# Altium project drone.PrjPcb
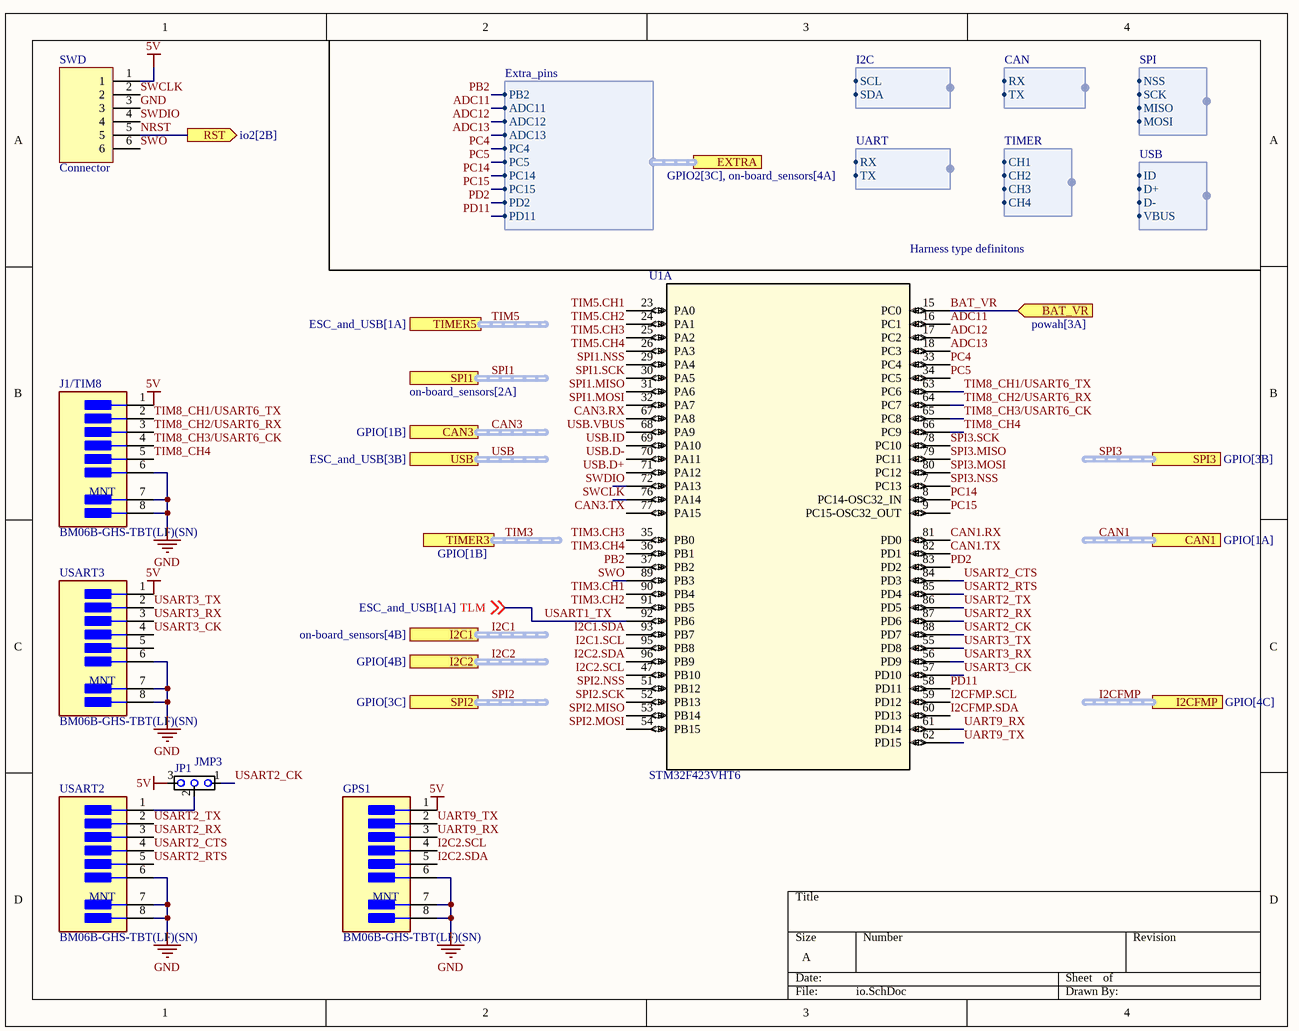
[diagram p0: io.SchDoc]
7 sheets, 93 parts. Net scope: flat (ports and power ports of the same name join across sheets).
Board file: PCB1.PcbDoc
Sheets:
  io.SchDoc
  io2.SchDoc
  powah.SchDoc
  on-board_sensors.SchDoc
  ESC_and_USB.SchDoc
  GPIO.SchDoc
  GPIO2.SchDoc

## Sheet io.SchDoc
size A; SheetNumber: 1; SheetTotal: 7

### Parts
GPS1  BM06B-GHS-TBT(LF)(SN)  [FP-SM06B-GHS-TB_LF_SN-MFG]
J1/TIM8  BM06B-GHS-TBT(LF)(SN)  [FP-SM06B-GHS-TB_LF_SN-MFG]
JP1  JMP3  [JMP3]
SWD  Connector  [FP_CONN6_TAP_254MM]
U1  STM32F423VHT6  [LQFP100-14x14mm]  (part A of 3)
USART2  BM06B-GHS-TBT(LF)(SN)  [FP-SM06B-GHS-TB_LF_SN-MFG]
USART3  BM06B-GHS-TBT(LF)(SN)  [FP-SM06B-GHS-TB_LF_SN-MFG]

### Ports
BAT_VR (in, see powah[3A]), CAN1 (harness CAN, see GPIO[1A]), CAN3 (harness CAN, see GPIO[1B]), EXTRA (harness Extra_pins, see GPIO2[3C], on-board_sensors[4A]), I2C1 (harness I2C, see on-board_sensors[4B]), I2C2 (harness I2C, see GPIO[4B]), I2CFMP (harness I2C, see GPIO[4C]), RST (out, see io2[2B]), SPI1 (harness SPI, see on-board_sensors[2A]), SPI2 (harness SPI, see GPIO[3C]), SPI3 (harness SPI, see GPIO[3B]), TIMER3 (harness TIMER, see GPIO[1B]), TIMER5 (harness TIMER, see ESC_and_USB[1A]), USB (harness USB, see ESC_and_USB[3B])

### Harnesses
USB: ID, D+, D-, VBUS
SPI: NSS, SCK, MISO, MOSI
TIMER: CH1, CH2, CH3, CH4
CAN: RX, TX
I2C: SCL, SDA
Extra_pins: PB2, ADC11, ADC12, ADC13, PC4, PC5, PC14, PC15, PD2, PD11
UART: RX, TX

### Nets
5V: GPS1.1 J1/TIM8.1 JP1.3 SWD.1 USART3.1
GND: GPS1.6 GPS1.7(MNT_1) GPS1.8(MNT_2) J1/TIM8.6 J1/TIM8.7(MNT_1) J1/TIM8.8(MNT_2) SWD.3 USART2.6 USART2.7(MNT_1) USART2.8(MNT_2) USART3.6 USART3.7(MNT_1) USART3.8(MNT_2)
ADC11: U1.16(PC1) ; port EXTRA.ADC11
ADC12: U1.17(PC2) ; port EXTRA.ADC12
ADC13: U1.18(PC3) ; port EXTRA.ADC13
BAT_VR: U1.15(PC0) ; port BAT_VR
CAN1.RX: U1.81(PD0)
CAN1.TX: U1.82(PD1)
CAN3.RX: U1.67(PA8)
CAN3.TX: U1.77(PA15)
I2C1.SCL: U1.95(PB8)
I2C1.SDA: U1.93(PB7)
I2C2.SCL: GPS1.4 U1.47(PB10)
I2C2.SDA: GPS1.5 U1.96(PB9)
I2CFMP.SCL: U1.59(PD12)
I2CFMP.SDA: U1.60(PD13)
NRST: SWD.5 ; port RST
PB2: U1.37(PB2) ; port EXTRA.PB2  [project net Extra.PB2]
PC4: U1.33(PC4) ; port EXTRA.PC4  [project net Extra.PC4]
PC5: U1.34(PC5) ; port EXTRA.PC5  [project net Extra.PC5]
PC14: U1.8(PC14-OSC32_IN) ; port EXTRA.PC14  [project net Extra.PC14]
PC15: U1.9(PC15-OSC32_OUT) ; port EXTRA.PC15  [project net Extra.PC15]
PD2: U1.83(PD2) ; port EXTRA.PD2  [project net Extra.PD2]
PD11: U1.58(PD11) ; port EXTRA.PD11  [project net Extra.PD11]
SPI1.MISO: U1.31(PA6)
SPI1.MOSI: U1.32(PA7)
SPI1.NSS: U1.29(PA4)
SPI1.SCK: U1.30(PA5)
SPI2.MISO: U1.53(PB14)
SPI2.MOSI: U1.54(PB15)
SPI2.NSS: U1.51(PB12)
SPI2.SCK: U1.52(PB13)
SPI3.MISO: U1.79(PC11)
SPI3.MOSI: U1.80(PC12)
SPI3.NSS: U1.7(PC13)
SPI3.SCK: U1.78(PC10)
SWCLK: SWD.2 U1.76(PA14)
SWDIO: SWD.4 U1.72(PA13)
SWO: SWD.6 U1.89(PB3)
TIM3.CH1: U1.90(PB4)
TIM3.CH2: U1.91(PB5)
TIM3.CH3: U1.35(PB0)
TIM3.CH4: U1.36(PB1)
TIM5.CH1: U1.23(PA0)
TIM5.CH2: U1.24(PA1)
TIM5.CH3: U1.25(PA2)
TIM5.CH4: U1.26(PA3)
TIM8_CH1/USART6_TX: J1/TIM8.2 U1.63(PC6)
TIM8_CH2/USART6_RX: J1/TIM8.3 U1.64(PC7)
TIM8_CH3/USART6_CK: J1/TIM8.4 U1.65(PC8)
TIM8_CH4: J1/TIM8.5 U1.66(PC9)
TLM: U1.92(PB6) ; off-sheet TLM  [also labelled USART1_TX]
UART9_RX: GPS1.3 U1.61(PD14)
UART9_TX: GPS1.2 U1.62(PD15)
USART2_CK: JP1.1 U1.88(PD7)
USART2_CTS: U1.84(PD3) USART2.4
USART2_RTS: U1.85(PD4) USART2.5
USART2_RX: U1.87(PD6) USART2.3
USART2_TX: U1.86(PD5) USART2.2
USART3_CK: U1.57(PD10) USART3.4
USART3_RX: U1.56(PD9) USART3.3
USART3_TX: U1.55(PD8) USART3.2
USB.D+: U1.71(PA12)
USB.D-: U1.70(PA11)
USB.ID: U1.69(PA10)
USB.VBUS: U1.68(PA9)
NetJP1_2: JP1.2 USART2.1

Not connected (* = marked no-connect by the designer): USART3 5

### Buses and harness runs
harness CAN1 = port CAN1
harness CAN3 = port CAN3
harness I2C1 = port I2C1
harness I2C2 = port I2C2
harness I2CFMP = port I2CFMP
harness SPI1 = port SPI1
harness SPI2 = port SPI2
harness SPI3 = port SPI3
harness TIM3 = port TIMER3
harness TIM5 = port TIMER5
harness USB = port USB

### Notes on the sheet
- Harness type definitons
- (in symbol CMP-17439-000166-1) MNT

### Library data of the parts
GPS1 J1/TIM8 USART2 USART3 = CMP-17439-000166-1: 6p; Pitch: 1.25mm; Number of Contacts: 6; Current Rating: 1A; Voltage Rating: 50V; Housing Material: Nylon; Lead Free: Lead Free; Packaging: Cut Tape; Number of Rows: 1; Series: GH; Contact Material: Bronze; Orientation: Straight; Termination: Solder; Mount: Surface Mount; Housing Color: Natural; Number of Positions: 6
SWD = Connector_6pin: 6pin connector
U1 = STM32F423VHT6: No Description Available; Mfr_Name: STMicroelectronics; RefDes: RefDes; Type: Type

## Sheet io2.SchDoc
size A; SheetNumber: 2; SheetTotal: 7
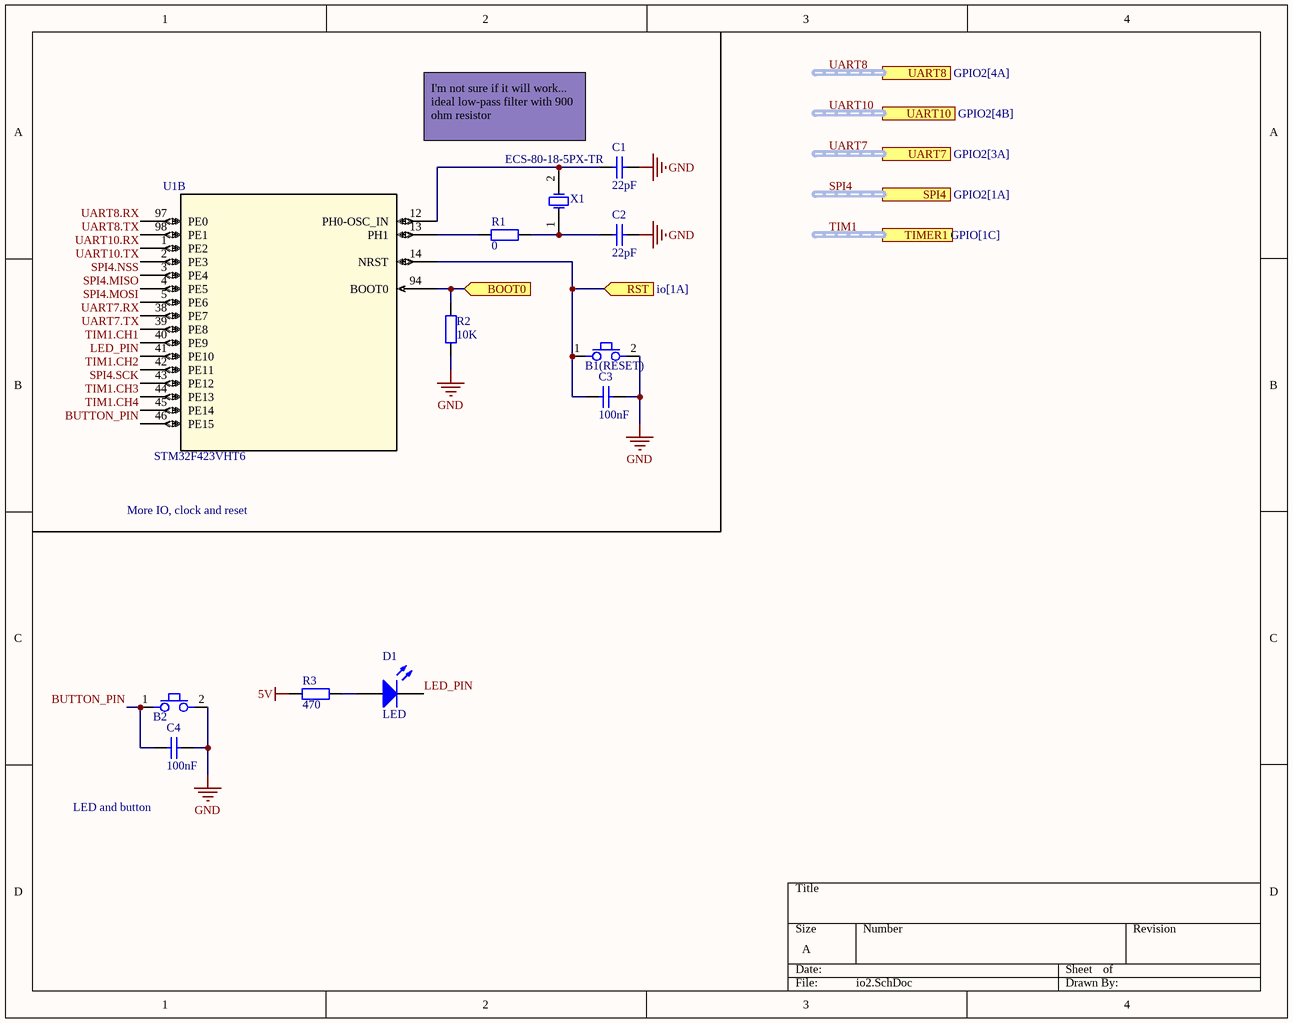
[diagram p1: io2.SchDoc]

### Parts
B1(RESET)  Button  [FP_BTN_SMD_3x6]  (value not drawn)
B2  Button  [FP_BTN_SMD_3x6]  (value not drawn)
C1  22pF  [FP_0805_CAP_085]
C2  22pF  [FP_0805_CAP_085]
C3  100nF  [FP_0805_CAP_085]
C4  100nF  [FP_0805_CAP_085]
D1  LED  [FP_0805_LED_BLUE]
R1  0  [FP_0805_RES]
R2  10K  [FP_0805_RES]
R3  470  [FP_0805_RES]
U1  STM32F423VHT6  [LQFP100-14x14mm]  (part B of 3)
X1  ECS-80-18-5PX-TR  [ECS-80-18-5PX-TR_V]

### Ports
BOOT0 (in), RST (in, see io[1A]), SPI4 (harness SPI, see GPIO2[1A]), TIMER1 (harness TIMER, see GPIO[1C]), UART7 (harness UART, see GPIO2[3A]), UART8 (harness UART, see GPIO2[4A]), UART10 (harness UART, see GPIO2[4B])

### Nets
5V: R3.1
GND: B1(RESET).2 B2.2 C1.1 C2.1 C3.2 C4.2 R2.1
BUTTON_PIN: B2.1 C4.1 U1.46(PE15)
LED_PIN: D1.2(K) U1.41(PE10)
NRST: B1(RESET).1 C3.1 U1.14(NRST) ; port RST
SPI4.MISO: U1.4(PE5)
SPI4.MOSI: U1.5(PE6)
SPI4.NSS: U1.3(PE4)
SPI4.SCK: U1.43(PE12)
TIM1.CH1: U1.40(PE9)
TIM1.CH2: U1.42(PE11)
TIM1.CH3: U1.44(PE13)
TIM1.CH4: U1.45(PE14)
UART7.RX: U1.38(PE7)
UART7.TX: U1.39(PE8)
UART8.RX: U1.97(PE0)
UART8.TX: U1.98(PE1)
UART10.RX: U1.1(PE2)
UART10.TX: U1.2(PE3)
NetC1_2: C1.2 U1.12(PH0-OSC_IN) X1.2(X2)
NetC2_2: C2.2 R1.2 X1.1(X1)
NetD1_1: D1.1(A) R3.2
NetR1_1: R1.1 U1.13(PH1)
NetR2_2: R2.2 U1.94(BOOT0) ; port BOOT0

### Buses and harness runs
harness SPI4 = port SPI4
harness TIM1 = port TIMER1
harness UART7 = port UART7
harness UART8 = port UART8
harness UART10 = port UART10

### Notes on the sheet
- I'm not sure if it will work...  ideal low-pass filter with 900 ohm resistor
- More IO, clock and reset
- LED and button

### Library data of the parts
B1(RESET) B2 = Button 2P: Push button
C1-C4 = CAP: Capacitor
  C1 C2: Value: 22pF
  C3 C4: Value: 100nF
D1 = LED: Typical RED GaAs LED; pin to pad: 1>A 2>K; Supplier: lomex; Verified: false
R1-R3 = RES: Resistor
  R1: Value: 0
  R2: Value: 10K
  R3: Value: 470
U1 = STM32F423VHT6: as U1 on sheet io; RefDes: RefDes; Type: Type
X1 = CMP-2000-06193-1: Low Profile Quartz Crystal, 8.0 MHz, 2-Pin SMD, RoHS, Tape and Reel; Brand: ECS; Tolerance: 30PPM; Case Height: 4.3mm; Frequency: 8MHz; Frequency Stability: 50PPM; Case Length: 13.2mm; Case Width: 4.8mm; Load Capacitance: 18pF; Termination Style: SMD/SMT; Product Category: Crystals; Packaging: Reel; Package Reference: ECS-80-18-5PX-TR; Mounting Technology: SurfaceMount; Dimensions: 4.8mmWx13.2mmLx4.3mmH; Package Description: 2-Pin Surface Mount Device, Body 11.4 x 4.8 mm, Height 4.3 mm; Datasheet URL: https://www.ecsxtal.com/store/pdf/csm-7x.pdf; Datasheet Version: 05/2016; Manufacturer: ECS; Factory Pack Quantity: 1000; Manufacturer URL: https://www.ecsxtal.com/; Type: SMDQuartzCrystals; Mounting Style: SMD/SMT; Package / Case: HC-49/US; Operating Temperature Range: -10Cto+70C; RoHS: Details; Series: CSM-7X

## Sheet powah.SchDoc
size A; SheetNumber: 3; SheetTotal: 7
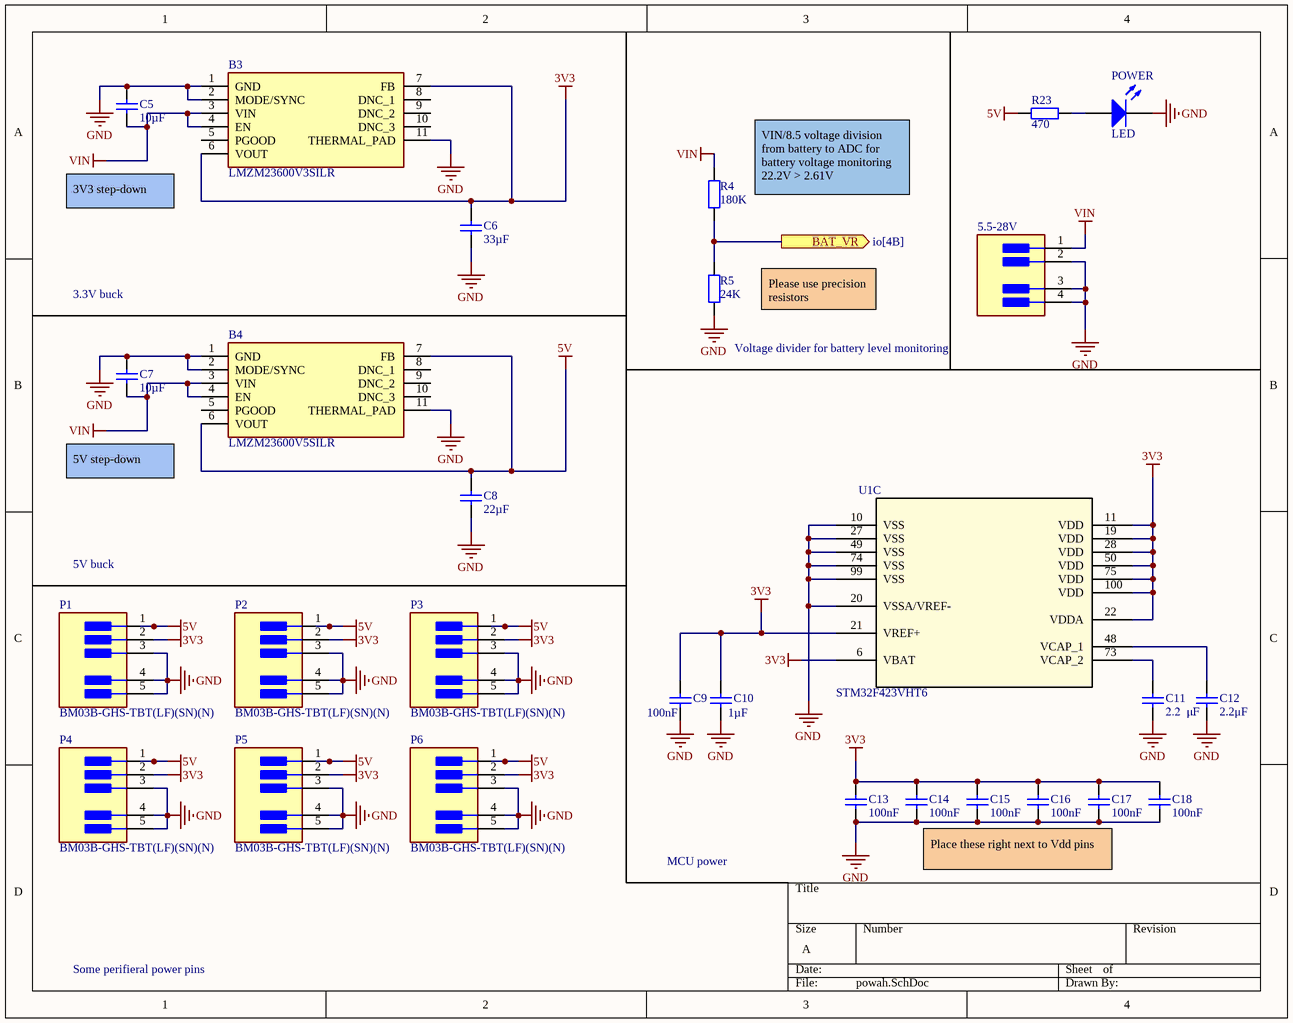
[diagram p2: powah.SchDoc]

### Parts
5.5-28V  (no value)  [FP-SM02B-GHS-TB_LF_SN-MFG]
B3  LMZM23600V3SILR  [LMZM23601V5SILR]
B4  LMZM23600V5SILR  [LMZM23601V5SILR]
C5  10µF  [FP_0805_CAP_085]
C6  33µF  [FP_0805_CAP_085]
C7  10µF  [FP_0805_CAP_085]
C8  22µF  [FP_0805_CAP_085]
C9  100nF  [FP_0805_CAP_085]
C10  1µF  [FP_0805_CAP_085]
C11  2.2μF  [FP_0805_CAP_085]
C12  2.2μF  [FP_0805_CAP_085]
C13  100nF  [FP_0805_CAP_085]
C14  100nF  [FP_0805_CAP_085]
C15  100nF  [FP_0805_CAP_085]
C16  100nF  [FP_0805_CAP_085]
C17  100nF  [FP_0805_CAP_085]
C18  100nF  [FP_0805_CAP_085]
P1  BM03B-GHS-TBT(LF)(SN)(N)  [FP-SM03B-GHS-TB_LF_SN-MFG]
P2  BM03B-GHS-TBT(LF)(SN)(N)  [FP-SM03B-GHS-TB_LF_SN-MFG]
P3  BM03B-GHS-TBT(LF)(SN)(N)  [FP-SM03B-GHS-TB_LF_SN-MFG]
P4  BM03B-GHS-TBT(LF)(SN)(N)  [FP-SM03B-GHS-TB_LF_SN-MFG]
P5  BM03B-GHS-TBT(LF)(SN)(N)  [FP-SM03B-GHS-TB_LF_SN-MFG]
P6  BM03B-GHS-TBT(LF)(SN)(N)  [FP-SM03B-GHS-TB_LF_SN-MFG]
POWER  LED  [FP_0805_LED_GREEN]
R4  180K  [FP_0805_RES]
R5  24K  [FP_0805_RES]
R23  470  [FP_0805_RES]
U1  STM32F423VHT6  [LQFP100-14x14mm]  (part C of 3)

### Ports
BAT_VR (out, see io[4B])

### Nets
3V3: B3.6(VOUT) B3.7(FB) C6.2 C9.2 C10.2 C13.2 C14.2 C15.2 C16.2 C17.2 C18.2 P1.2 P2.2 P3.2 P4.2 P5.2 P6.2 U1.6(VBAT) U1.11(VDD) U1.19(VDD) U1.21(VREF+) U1.22(VDDA) U1.28(VDD) U1.50(VDD) U1.75(VDD) U1.100(VDD)
5V: B4.6(VOUT) B4.7(FB) C8.2 P1.1 P2.1 P3.1 P4.1 P5.1 P6.1 R23.1
GND: 5.5-28V.2 5.5-28V.3(MNT_1) 5.5-28V.4(MNT_2) B3.1(GND) B3.2(MODE/SYNC) B3.11(THERMAL_PAD) B4.1(GND) B4.2(MODE/SYNC) B4.11(THERMAL_PAD) C5.2 C6.1 C7.2 C8.1 C9.1 C10.1 C11.1 C12.1 C13.1 C14.1 C15.1 C16.1 C17.1 C18.1 P1.3 P1.4(MNT_1) P1.5(MNT_2) P2.3 P2.4(MNT_1) P2.5(MNT_2) P3.3 P3.4(MNT_1) P3.5(MNT_2) P4.3 P4.4(MNT_1) P4.5(MNT_2) P5.3 P5.4(MNT_1) P5.5(MNT_2) P6.3 P6.4(MNT_1) P6.5(MNT_2) POWER.2(K) R5.1 U1.10(VSS) U1.20(VSSA/VREF-) U1.27(VSS) U1.49(VSS) U1.74(VSS) U1.99(VSS)
VIN: 5.5-28V.1 B3.3(VIN) B3.4(EN) B4.3(VIN) B4.4(EN) C5.1 C7.1 R4.2
BAT_VR: R4.1 R5.2 ; port BAT_VR
NetC11_2: C11.2 U1.73(VCAP_2)
NetC12_2: C12.2 U1.48(VCAP_1)
NetPOWER_1: POWER.1(A) R23.2

Not connected (* = marked no-connect by the designer): B3 5(PGOOD) 8(DNC_1) 9(DNC_2) 10(DNC_3); B4 5(PGOOD) 8(DNC_1) 9(DNC_2) 10(DNC_3)

### Notes on the sheet
- 3V3 step-down
- (near R4) VIN/8.5 voltage division from battery to ADC for battery voltage monitoring    22.2V > 2.61V
- 3.3V buck
- Voltage divider for battery level monitoring
- (near R5) Please use precision resistors
- 5V step-down
- 5V buck
- MCU power
- Place these right next to Vdd pins
- Some perifieral power pins

### Library data of the parts
5.5-28V = CMP-2000-05957-2: 2p; Pitch: 0.049inch; Connector Type: Outer Shroud Contact; Number of Positions: 2; Packaging: Tape and Reel; Lead Free: Lead Free; Termination: Solder; Fastening Type: Ramp; Number of Rows: 1; Color: Natural; Contact Plating: Tin; Mount: Surface Mount
B3 = LMZM23600V3SILR: 36-V, 0.5-A Step-Down DC/DC Power Module in 3.8-mm  3-mm Package; Manufacturer_Name: Texas Instruments; Geometry.Height: 1.578mm; Mouser Part Number: 595-LMZM23600V3SILR; Mouser Price/Stock: https://www.mouser.co.uk/ProductDetail/Texas-Instruments/LMZM23600V3SILR?qs=55YtniHzbhDJv8FpBtYOcw%3D%3D; Manufacturer_Part_Number: LMZM23600V3SILR; Datasheet Link: http://www.ti.com/lit/gpn/lmzm23600
B4 = LMZM23600V5SILR: 36-V, 0.5-A Step-Down DC/DC Power Module in 3.8-mm  3-mm Package; Manufacturer_Name: Texas Instruments; Geometry.Height: 1mm; Mouser Part Number: 595-LMZM23600V5SILR; Mouser Price/Stock: https://www.mouser.co.uk/ProductDetail/Texas-Instruments/LMZM23600V5SILR?qs=55YtniHzbhCRfZgYPiZvxw%3D%3D; Manufacturer_Part_Number: LMZM23600V5SILR; Datasheet Link: http://www.ti.com/lit/gpn/lmzm23600
C5-C18 = CAP: Capacitor
  C5 C7: Value: 10µF
  C6: Value: 33µF
  C8: Value: 22µF
  C9 C13-C18: Value: 100nF
  C10: Value: 1µF
  C12: Value: 2.2μF
P1-P6 = CMP-17439-000058-1: 3p; Pitch: 0.049inch; Number of Positions: 3; Connector Type: Header; Contact Finish - Mating: TIN; Lead Free: Lead Free; Series: GH; Fastening Type: Ramp; Number of Rows: 1; Insulation Color: Natural; Contact Material: Bronze; Insulation Material: Nylon; Min Operating Temperature: -25°C; Contact Type: Outer Shroud Contact; Max Operating Temperature: 85°C; Termination: Solder; Flammability Rating: UL94 V-0; Color: Natural; Contact Plating: Tin; Contact Shape: Rectangular; Mount: Surface Mount; Packaging: Cut Tape
POWER = LED: Typical RED GaAs LED; pin to pad: 1>A 2>K; Supplier: lomex; Verified: false
R4 R5 R23 = RES: Resistor
  R4: Value: 180K
  R5: Value: 24K
  R23: Value: 470
U1 = STM32F423VHT6: as U1 on sheet io; RefDes: RefDes; Type: Type

## Sheet on-board_sensors.SchDoc
size A; SheetNumber: 4; SheetTotal: 7
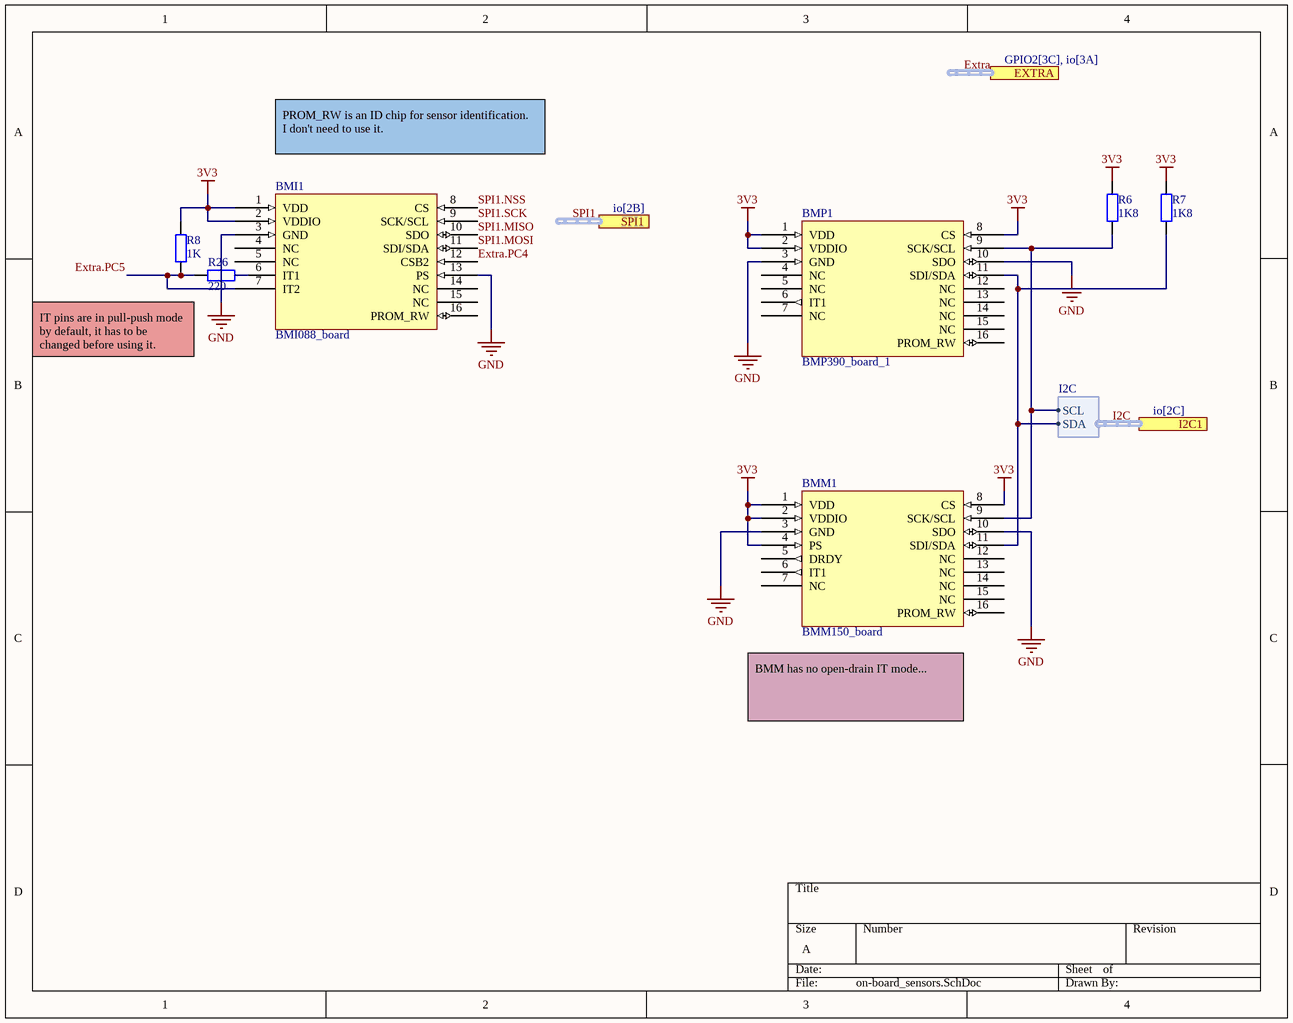
[diagram p3: on-board_sensors.SchDoc]

### Parts
BMI1  BMI088_board  [DIP7-9]
BMM1  BMM150_board  [DIP7-9]
BMP1  BMP390_board_1  [DIP7-9]
R6  1K8  [FP_0805_RES]
R7  1K8  [FP_0805_RES]
R8  1K  [FP_0805_RES]
R26  220  [FP_0805_RES]

### Ports
EXTRA (harness Extra_pins, see GPIO2[3C], io[3A]), I2C1 (harness I2C, see io[2C]), SPI1 (harness SPI, see io[2B])

### Harnesses
I2C: SCL, SDA

### Nets
3V3: BMI1.1(VDD) BMI1.2(VDDIO) BMM1.1(VDD) BMM1.2(VDDIO) BMM1.4(PS) BMM1.8(CS) BMP1.1(VDD) BMP1.2(VDDIO) BMP1.8(CS) R6.2 R7.2 R8.2
GND: BMI1.3(GND) BMI1.13(PS) BMM1.3(GND) BMM1.10(SDO) BMP1.3(GND) BMP1.10(SDO)
Extra.PC4: BMI1.12(CSB2)
Extra.PC5: BMI1.7(IT2) R8.1 R26.1
I2C.SCL: BMM1.9(SCK/SCL) BMP1.9(SCK/SCL) R6.1 ; port I2C1.SCL
I2C.SDA: BMM1.11(SDI/SDA) BMP1.11(SDI/SDA) R7.1 ; port I2C1.SDA
SPI1.MISO: BMI1.10(SDO)
SPI1.MOSI: BMI1.11(SDI/SDA)
SPI1.NSS: BMI1.8(CS)
SPI1.SCK: BMI1.9(SCK/SCL)
NetBMI1_6: BMI1.6(IT1) R26.2

Not connected (* = marked no-connect by the designer): BMI1 4(NC) 5(NC) 14(NC) 15(NC) 16(PROM_RW); BMM1 5(DRDY) 6(IT1) 7(NC) 12(NC) 13(NC) 14(NC) 15(NC) 16(PROM_RW); BMP1 4(NC) 5(NC) 6(IT1) 7(NC) 12(NC) 13(NC) 14(NC) 15(NC) 16(PROM_RW)

### Buses and harness runs
harness Extra = port EXTRA
harness I2C = port I2C1
harness SPI1 = port SPI1

### Notes on the sheet
- PROM_RW is an ID chip for sensor identification.
  I don't need to use it.
- IT pins are in pull-push mode by default, it has to be changed before using it.
- (near BMM1) BMM has no open-drain IT mode...

### Library data of the parts
R6-R8 R26 = RES: Resistor
  R6 R7: Value: 1K8
  R8: Value: 1K
  R26: Value: 220

## Sheet ESC_and_USB.SchDoc
size A; SheetNumber: 5; SheetTotal: 7
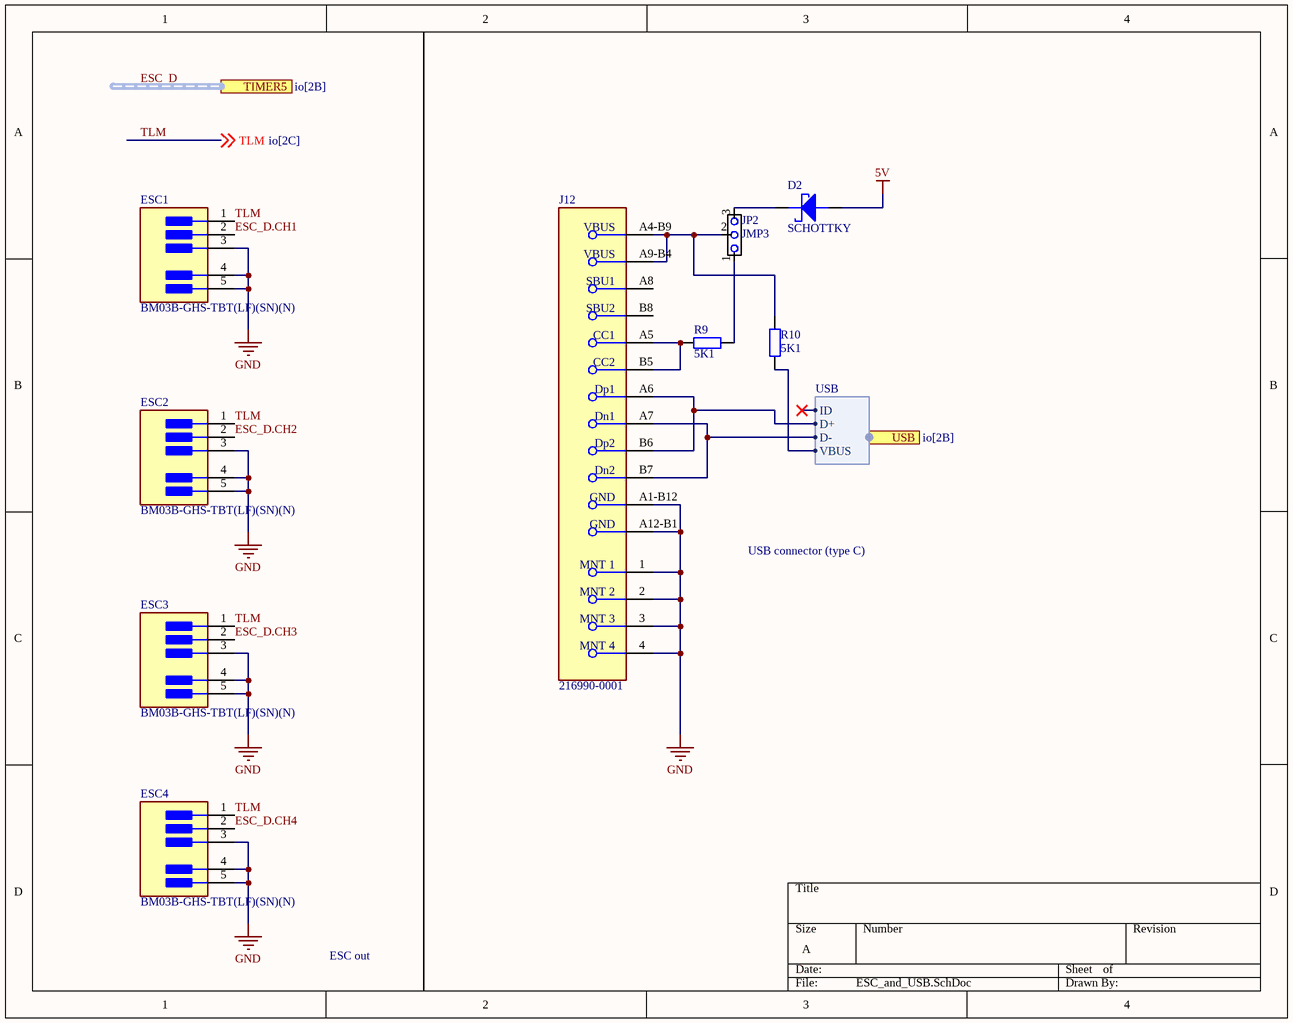
[diagram p4: ESC_and_USB.SchDoc]

### Parts
D2  SCHOTTKY  [FP_SMA]
ESC1  BM03B-GHS-TBT(LF)(SN)(N)  [FP-SM03B-GHS-TB_LF_SN-MFG]
ESC2  BM03B-GHS-TBT(LF)(SN)(N)  [FP-SM03B-GHS-TB_LF_SN-MFG]
ESC3  BM03B-GHS-TBT(LF)(SN)(N)  [FP-SM03B-GHS-TB_LF_SN-MFG]
ESC4  BM03B-GHS-TBT(LF)(SN)(N)  [FP-SM03B-GHS-TB_LF_SN-MFG]
J12  216990-0001  [USBC-FP-216990-0001-MFG]
JP2  JMP3  [JMP3]
R9  5K1  [FP_0805_RES]
R10  5K1  [FP_0805_RES]

### Ports
TIMER5 (harness TIMER, see io[2B]), USB (harness USB, see io[2B])

### Harnesses
USB: ID, D+, D-, VBUS

### Nets
5V: D2.1(ANODE)
GND: ESC1.3 ESC1.4(MNT_1) ESC1.5(MNT_2) ESC2.3 ESC2.4(MNT_1) ESC2.5(MNT_2) ESC3.3 ESC3.4(MNT_1) ESC3.5(MNT_2) ESC4.3 ESC4.4(MNT_1) ESC4.5(MNT_2) J12.1(MNT_1) J12.2(MNT_2) J12.3(MNT_3) J12.4(MNT_4) J12.A1-B12(GND) J12.A12-B1(GND)
ESC_D.CH1: ESC1.2
ESC_D.CH2: ESC2.2
ESC_D.CH3: ESC3.2
ESC_D.CH4: ESC4.2
TLM: ESC1.1 ESC2.1 ESC3.1 ESC4.1 ; off-sheet TLM
USB.D+: J12.A6(Dp1) J12.B6(Dp2) ; port USB.D+
USB.D-: J12.A7(Dn1) J12.B7(Dn2) ; port USB.D-
USB.VBUS: R10.1 ; port USB.VBUS
NetD2_2: D2.2(CATHODE) JP2.3
NetJ12_A4-B9: J12.A4-B9(VBUS) J12.A9-B4(VBUS) JP2.2 R10.2
NetJ12_A5: J12.A5(CC1) J12.B5(CC2) R9.1
NetJP2_1: JP2.1 R9.2

Not connected (* = marked no-connect by the designer): J12 A8(SBU1) B8(SBU2)

### Buses and harness runs
harness ESC_D = port TIMER5

### Notes on the sheet
- USB connector (type C)
- ESC out

### Library data of the parts
D2 = SCHOTTKY: Schottky diode
ESC1-ESC4 = CMP-17439-000058-1: as P1 on sheet powah; Contact Finish - Mating: TIN; Lead Free: Lead Free; Series: GH; Fastening Type: Ramp; Number of Rows: 1; Insulation Color: Natural; Contact Material: Bronze; Insulation Material: Nylon; Min Operating Temperature: -25°C; Contact Type: Outer Shroud Contact; Max Operating Temperature: 85°C; Termination: Solder; Flammability Rating: UL94 V-0; Color: Natural; Contact Plating: Tin; Contact Shape: Rectangular; Mount: Surface Mount; Packaging: Cut Tape
J12 = CMP-04767-000014-1: CONN RCP USB2.0 TYP C 24P SMD RA
R9 R10 = RES: Resistor; Value: 5K1

## Sheet GPIO.SchDoc
size A; SheetNumber: 6; SheetTotal: 7
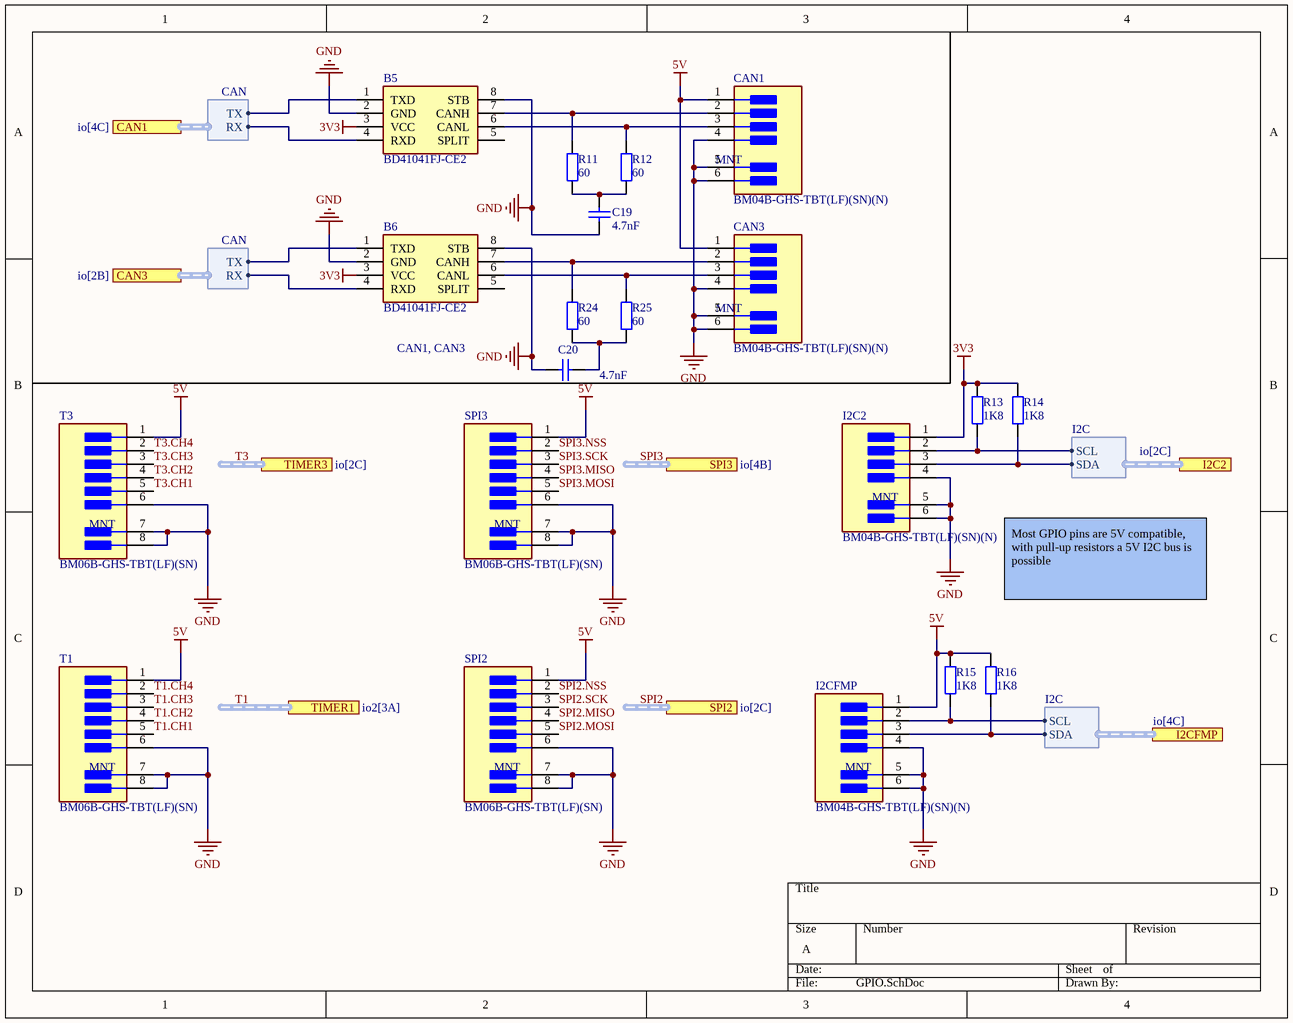
[diagram p5: GPIO.SchDoc]

### Parts
B5  BD41041FJ-CE2  [SOIC127P600X165-8N]
B6  BD41041FJ-CE2  [SOIC127P600X165-8N]
C19  4.7nF  [FP_0805_CAP_085]
C20  4.7nF  [FP_0805_CAP_085]
CAN1  BM04B-GHS-TBT(LF)(SN)(N)  [FP-SM04B-GHS-TB_LF_SN-MFG]
CAN3  BM04B-GHS-TBT(LF)(SN)(N)  [FP-SM04B-GHS-TB_LF_SN-MFG]
I2C2  BM04B-GHS-TBT(LF)(SN)(N)  [FP-BM04B-GHS-TBT_LF_SN-MFG]
I2CFMP  BM04B-GHS-TBT(LF)(SN)(N)  [FP-BM04B-GHS-TBT_LF_SN-MFG]
R11  60  [FP_0805_RES]
R12  60  [FP_0805_RES]
R13  1K8  [FP_0805_RES]
R14  1K8  [FP_0805_RES]
R15  1K8  [FP_0805_RES]
R16  1K8  [FP_0805_RES]
R24  60  [FP_0805_RES]
R25  60  [FP_0805_RES]
SPI2  BM06B-GHS-TBT(LF)(SN)  [FP-SM06B-GHS-TB_LF_SN-MFG]
SPI3  BM06B-GHS-TBT(LF)(SN)  [FP-SM06B-GHS-TB_LF_SN-MFG]
T1  BM06B-GHS-TBT(LF)(SN)  [FP-BM06B-GHS-TBT_LF_SN-MFG]
T3  BM06B-GHS-TBT(LF)(SN)  [FP-BM06B-GHS-TBT_LF_SN-MFG]

### Ports
CAN1 (harness CAN, see io[4C]), CAN3 (harness CAN, see io[2B]), I2C2 (harness I2C, see io[2C]), I2CFMP (harness I2C, see io[4C]), SPI2 (harness SPI, see io[2C]), SPI3 (harness SPI, see io[4B]), TIMER1 (harness TIMER, see io2[3A]), TIMER3 (harness TIMER, see io[2C])

### Harnesses
CAN: RX, TX
I2C: SCL, SDA

### Nets
3V3: B5.3(VCC) B6.3(VCC) I2C2.1 R13.2 R14.2
5V: CAN1.1 CAN3.1 I2CFMP.1 R15.2 R16.2 SPI2.1 SPI3.1 T1.1 T3.1
GND: B5.2(GND) B5.8(STB) B6.2(GND) B6.8(STB) C19.1 C20.2 CAN1.4 CAN1.5(MNT_1) CAN1.6(MNT_2) CAN3.4 CAN3.5(MNT_1) CAN3.6(MNT_2) I2C2.4 I2C2.5(MNT_1) I2C2.6(MNT_2) I2CFMP.4 I2CFMP.5(MNT_1) I2CFMP.6(MNT_2) SPI2.6 SPI2.7(MNT_1) SPI2.8(MNT_2) SPI3.6 SPI3.7(MNT_1) SPI3.8(MNT_2) T1.6 T1.7(MNT_1) T1.8(MNT_2) T3.6 T3.7(MNT_1) T3.8(MNT_2)
CAN1.RX: B5.4(RXD) ; port CAN1.RX
CAN1.TX: B5.1(TXD) ; port CAN1.TX
CAN3.RX: B6.4(RXD) ; port CAN3.RX
CAN3.TX: B6.1(TXD) ; port CAN3.TX
I2C2.SCL: I2C2.2 R13.1 ; port I2C2.SCL
I2C2.SDA: I2C2.3 R14.1 ; port I2C2.SDA
I2CFMP.SCL: I2CFMP.2 R15.1 ; port I2CFMP.SCL
I2CFMP.SDA: I2CFMP.3 R16.1 ; port I2CFMP.SDA
SPI2.MISO: SPI2.4
SPI2.MOSI: SPI2.5
SPI2.NSS: SPI2.2
SPI2.SCK: SPI2.3
SPI3.MISO: SPI3.4
SPI3.MOSI: SPI3.5
SPI3.NSS: SPI3.2
SPI3.SCK: SPI3.3
T1.CH1: T1.5
T1.CH2: T1.4
T1.CH3: T1.3
T1.CH4: T1.2
T3.CH1: T3.5
T3.CH2: T3.4
T3.CH3: T3.3
T3.CH4: T3.2
NetB5_6: B5.6(CANL) CAN1.3 R12.2
NetB5_7: B5.7(CANH) CAN1.2 R11.2
NetB6_6: B6.6(CANL) CAN3.3 R25.2
NetB6_7: B6.7(CANH) CAN3.2 R24.2
NetC19_2: C19.2 R11.1 R12.1
NetC20_1: C20.1 R24.1 R25.1

Not connected (* = marked no-connect by the designer): B5 5(SPLIT); B6 5(SPLIT)

### Buses and harness runs
harness SPI2 = port SPI2
harness SPI3 = port SPI3
harness T1 = port TIMER1
harness T3 = port TIMER3

### Notes on the sheet
- CAN1, CAN3
- Most GPIO pins are 5V compatible, with pull-up resistors a 5V I2C bus is possible
- (in symbol CMP-17439-000054-1) MNT
- (in symbol CMP-17439-000166-1) MNT

### Library data of the parts
B5 B6 = BD41041FJ-CE2: ROHM Semiconductor CAN Transceiver for Automotive; Geometry.Height: 1.65mm; Mouser Part Number: 755-BD41041FJ-CE2; Mouser Price/Stock: https://www.mouser.co.uk/ProductDetail/ROHM-Semiconductor/BD41041FJ-CE2?qs=%252BEew9%252B0nqrCizAYMbF4Vxg%3D%3D; Manufacturer_Name: ROHM Semiconductor; Manufacturer_Part_Number: BD41041FJ-CE2; Datasheet Link: https://datasheet.datasheetarchive.com/originals/distributors/Datasheets_SAMA/414644ee1dc91df04c2a44596c540576.pdf
C19 C20 = CAP: Capacitor; Value: 4.7nF
CAN1 CAN3 I2C2 I2CFMP = CMP-17439-000054-1: 4p; Number of Positions: 4; Pitch: 0.049inch; Connector Type: Outer Shroud Contact; Termination: Solder; Number of Pins: 4; Color: Natural; Number of Rows: 1; Lead Free: Lead Free; Mount: Surface Mount; Contact Plating: Tin; Packaging: Tape and Reel; Fastening Type: Ramp
R11-R16 R24 R25 = RES: Resistor
  R11 R12 R24 R25: Value: 60
  R13-R16: Value: 1K8
SPI2 SPI3 T1 T3 = CMP-17439-000166-1: as GPS1 on sheet io; Housing Material: Nylon; Lead Free: Lead Free; Packaging: Cut Tape; Number of Rows: 1; Series: GH; Contact Material: Bronze; Orientation: Straight; Termination: Solder; Mount: Surface Mount; Housing Color: Natural; Number of Positions: 6

## Sheet GPIO2.SchDoc
size A; SheetNumber: 7; SheetTotal: 7
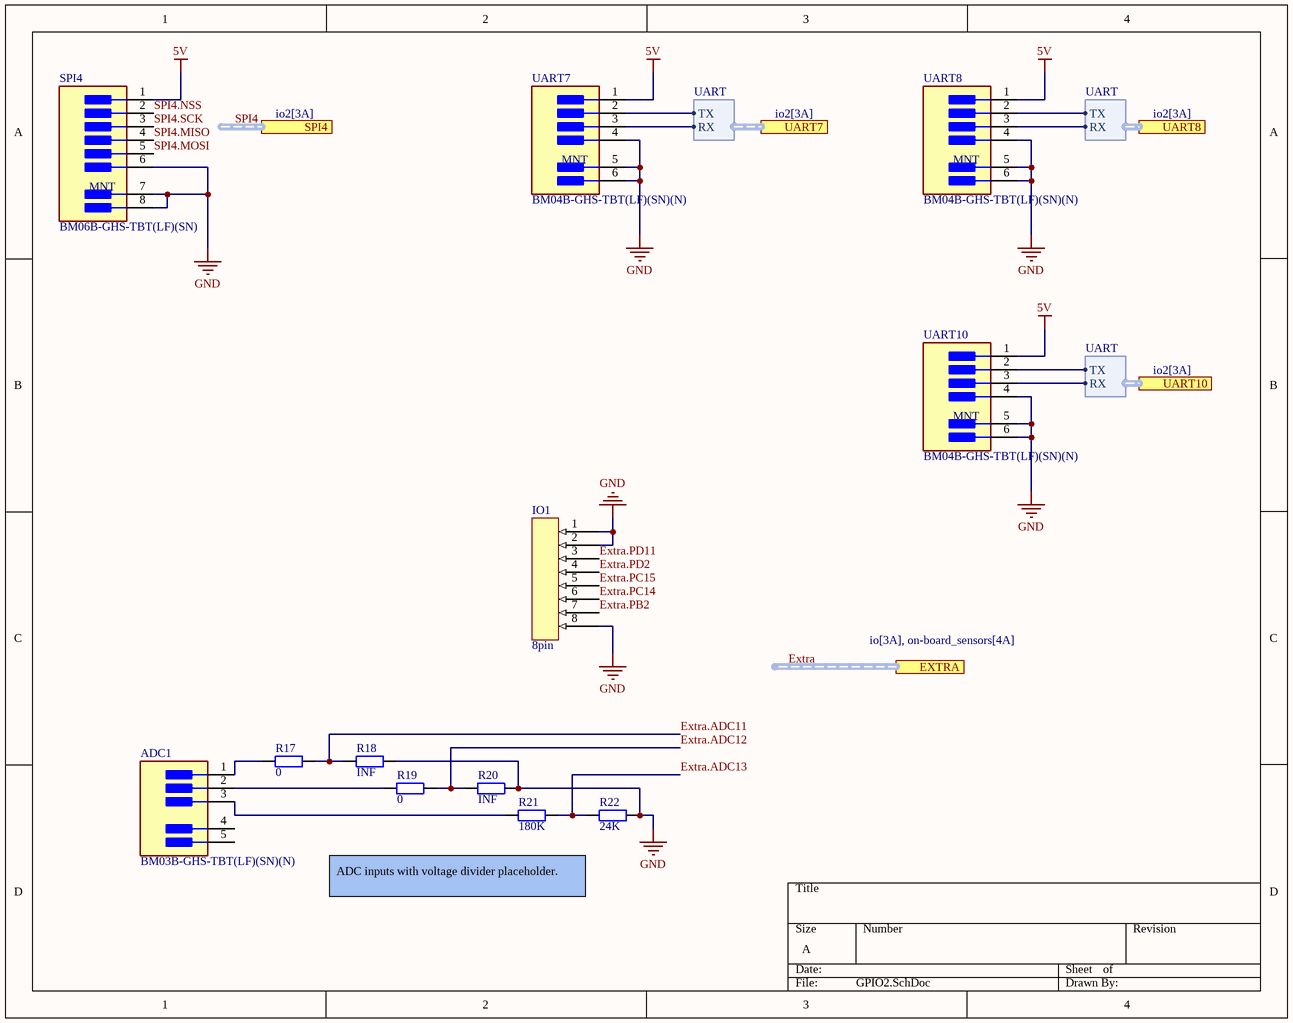
[diagram p6: GPIO2.SchDoc]

### Parts
ADC1  BM03B-GHS-TBT(LF)(SN)(N)  [FP-SM03B-GHS-TB_LF_SN-MFG]
IO1  8pin  [PINS 8x1]
R17  0  [FP_0805_RES]
R18  INF  [FP_0805_RES]
R19  0  [FP_0805_RES]
R20  INF  [FP_0805_RES]
R21  180K  [FP_0805_RES]
R22  24K  [FP_0805_RES]
SPI4  BM06B-GHS-TBT(LF)(SN)  [FP-SM06B-GHS-TB_LF_SN-MFG]
UART7  BM04B-GHS-TBT(LF)(SN)(N)  [FP-SM04B-GHS-TB_LF_SN-MFG]
UART8  BM04B-GHS-TBT(LF)(SN)(N)  [FP-SM04B-GHS-TB_LF_SN-MFG]
UART10  BM04B-GHS-TBT(LF)(SN)(N)  [FP-SM04B-GHS-TB_LF_SN-MFG]

### Ports
EXTRA (harness Extra_pins, see io[3A], on-board_sensors[4A]), SPI4 (harness SPI, see io2[3A]), UART7 (harness UART, see io2[3A]), UART8 (harness UART, see io2[3A]), UART10 (harness UART, see io2[3A])

### Harnesses
UART: RX, TX

### Nets
5V: SPI4.1 UART7.1 UART8.1 UART10.1
GND: IO1.1 IO1.2 IO1.8 R18.2 R20.2 R22.2 SPI4.6 SPI4.7(MNT_1) SPI4.8(MNT_2) UART7.4 UART7.5(MNT_1) UART7.6(MNT_2) UART8.4 UART8.5(MNT_1) UART8.6(MNT_2) UART10.4 UART10.5(MNT_1) UART10.6(MNT_2)
Extra.ADC11: R17.2 R18.1
Extra.ADC12: R19.2 R20.1
Extra.ADC13: R21.2 R22.1
Extra.PB2: IO1.7
Extra.PC14: IO1.6
Extra.PC15: IO1.5
Extra.PD2: IO1.4
Extra.PD11: IO1.3
SPI4.MISO: SPI4.4
SPI4.MOSI: SPI4.5
SPI4.NSS: SPI4.2
SPI4.SCK: SPI4.3
UART7.RX: UART7.3 ; port UART7.RX
UART7.TX: UART7.2 ; port UART7.TX
UART8.RX: UART8.3 ; port UART8.RX
UART8.TX: UART8.2 ; port UART8.TX
UART10.RX: UART10.3 ; port UART10.RX
UART10.TX: UART10.2 ; port UART10.TX
NetADC1_1: ADC1.1 R17.1
NetADC1_2: ADC1.2 R19.1
NetADC1_3: ADC1.3 R21.1

Not connected (* = marked no-connect by the designer): ADC1 4(MNT_1) 5(MNT_2)

### Buses and harness runs
harness Extra = port EXTRA
harness SPI4 = port SPI4

### Notes on the sheet
- ADC inputs with voltage divider placeholder.
- (in symbol CMP-17439-000054-1) MNT
- (in symbol CMP-17439-000166-1) MNT

### Library data of the parts
ADC1 = CMP-17439-000058-1: as P1 on sheet powah; Contact Finish - Mating: TIN; Lead Free: Lead Free; Series: GH; Fastening Type: Ramp; Number of Rows: 1; Insulation Color: Natural; Contact Material: Bronze; Insulation Material: Nylon; Min Operating Temperature: -25°C; Contact Type: Outer Shroud Contact; Max Operating Temperature: 85°C; Termination: Solder; Flammability Rating: UL94 V-0; Color: Natural; Contact Plating: Tin; Contact Shape: Rectangular; Mount: Surface Mount; Packaging: Cut Tape
R17-R22 = RES: Resistor
  R17 R19: Value: 0
  R18 R20: Value: INF
  R21: Value: 180K
  R22: Value: 24K
SPI4 = CMP-17439-000166-1: as GPS1 on sheet io; Housing Material: Nylon; Lead Free: Lead Free; Packaging: Cut Tape; Number of Rows: 1; Series: GH; Contact Material: Bronze; Orientation: Straight; Termination: Solder; Mount: Surface Mount; Housing Color: Natural; Number of Positions: 6
UART7 UART8 UART10 = CMP-17439-000054-1: as CAN1 on sheet GPIO; Termination: Solder; Number of Pins: 4; Color: Natural; Number of Rows: 1; Lead Free: Lead Free; Mount: Surface Mount; Contact Plating: Tin; Packaging: Tape and Reel; Fastening Type: Ramp

## Nets that join several sheets
3V3: powah (26 pins), on-board_sensors (12 pins), GPIO (5 pins)
5V: io (5 pins), io2 (R3.1), powah (10 pins), ESC_and_USB (D2.1), GPIO (9 pins), GPIO2 (SPI4.1 UART7.1 UART8.1 UART10.1)
GND: io (13 pins), io2 (7 pins), powah (49 pins), on-board_sensors (6 pins), ESC_and_USB (18 pins), GPIO (30 pins), GPIO2 (18 pins)
BAT_VR: io (U1.15), powah (R4.1 R5.2)
NRST: io (SWD.5), io2 (B1(RESET).1 C3.1 U1.14)
TLM: io (U1.92), ESC_and_USB (ESC1.1 ESC2.1 ESC3.1 ESC4.1)